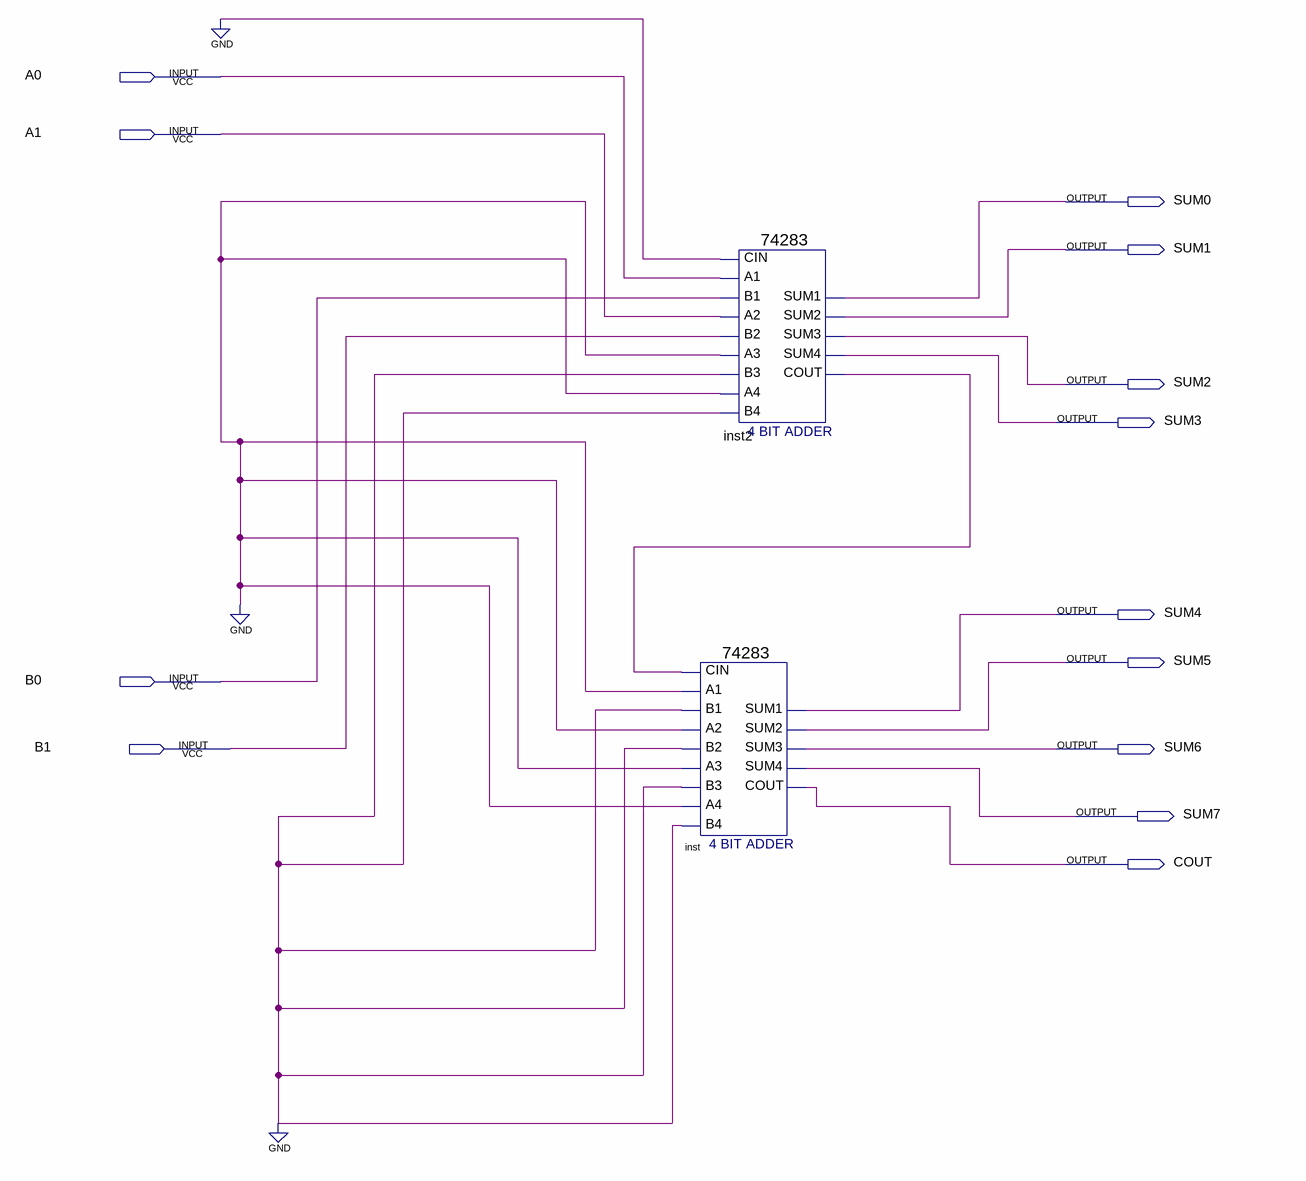
[diagram p0: schematic sheet]
// Quartus schematic 8bitaddition.bdf as structural Verilog: 2 symbols, 13 pins
module \8bitaddition  (
  input  A0,
  input  A1,
  input  B0,
  input  B1,
  output SUM0,
  output SUM1,
  output SUM2,
  output SUM3,
  output SUM4,
  output SUM5,
  output SUM6,
  output SUM7,
  output COUT
);

  wire inst2_cout;

  \74283  inst (
    .CIN(inst2_cout), .A1(1'b0), .A2(1'b0), .B2(1'b0), .A3(1'b0), .A4(1'b0), .B4(1'b0), .B1(1'b0), .B3(1'b0),
    .SUM4(SUM7), .COUT(COUT), .SUM1(SUM4), .SUM2(SUM5), .SUM3(SUM6));
  \74283  inst2 (
    .CIN(1'b0), .A1(A0), .A2(A1), .B2(B1), .A3(1'b0), .A4(1'b0), .B4(1'b0), .B1(B0), .B3(1'b0), .SUM4(SUM3),
    .COUT(inst2_cout), .SUM1(SUM0), .SUM2(SUM1), .SUM3(SUM2));
endmodule
